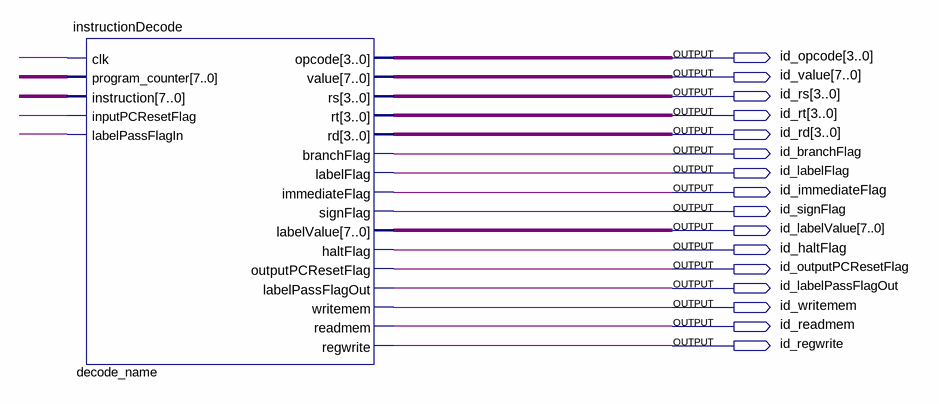
[diagram p0: schematic sheet]
// Quartus schematic test_instructionDecode.bdf as structural Verilog: 1 symbols, 16 pins
module test_instructionDecode (
  output [3:0] id_opcode,
  output [7:0] id_value,
  output [3:0] id_rs,
  output [3:0] id_rt,
  output [3:0] id_rd,
  output id_branchFlag,
  output id_labelFlag,
  output id_immediateFlag,
  output id_signFlag,
  output [7:0] id_labelValue,
  output id_haltFlag,
  output id_outputPCResetFlag,
  output id_labelPassFlagOut,
  output id_writemem,
  output id_readmem,
  output id_regwrite
);

  wire undriven, undriven_2, undriven_5;
  wire [7:0] undriven_3, undriven_4;

  instructionDecode decode_name (
    .clk(undriven_5), .program_counter(undriven_4), .instruction(undriven_3), .inputPCResetFlag(undriven_2),
    .labelPassFlagIn(undriven), .opcode(id_opcode), .value(id_value), .rs(id_rs), .rt(id_rt), .rd(id_rd),
    .branchFlag(id_branchFlag), .labelFlag(id_labelFlag), .immediateFlag(id_immediateFlag),
    .signFlag(id_signFlag), .labelValue(id_labelValue), .haltFlag(id_haltFlag),
    .outputPCResetFlag(id_outputPCResetFlag), .labelPassFlagOut(id_labelPassFlagOut), .writemem(id_writemem),
    .readmem(id_readmem), .regwrite(id_regwrite));
endmodule
